# Altium project H-00488.PrjPcb
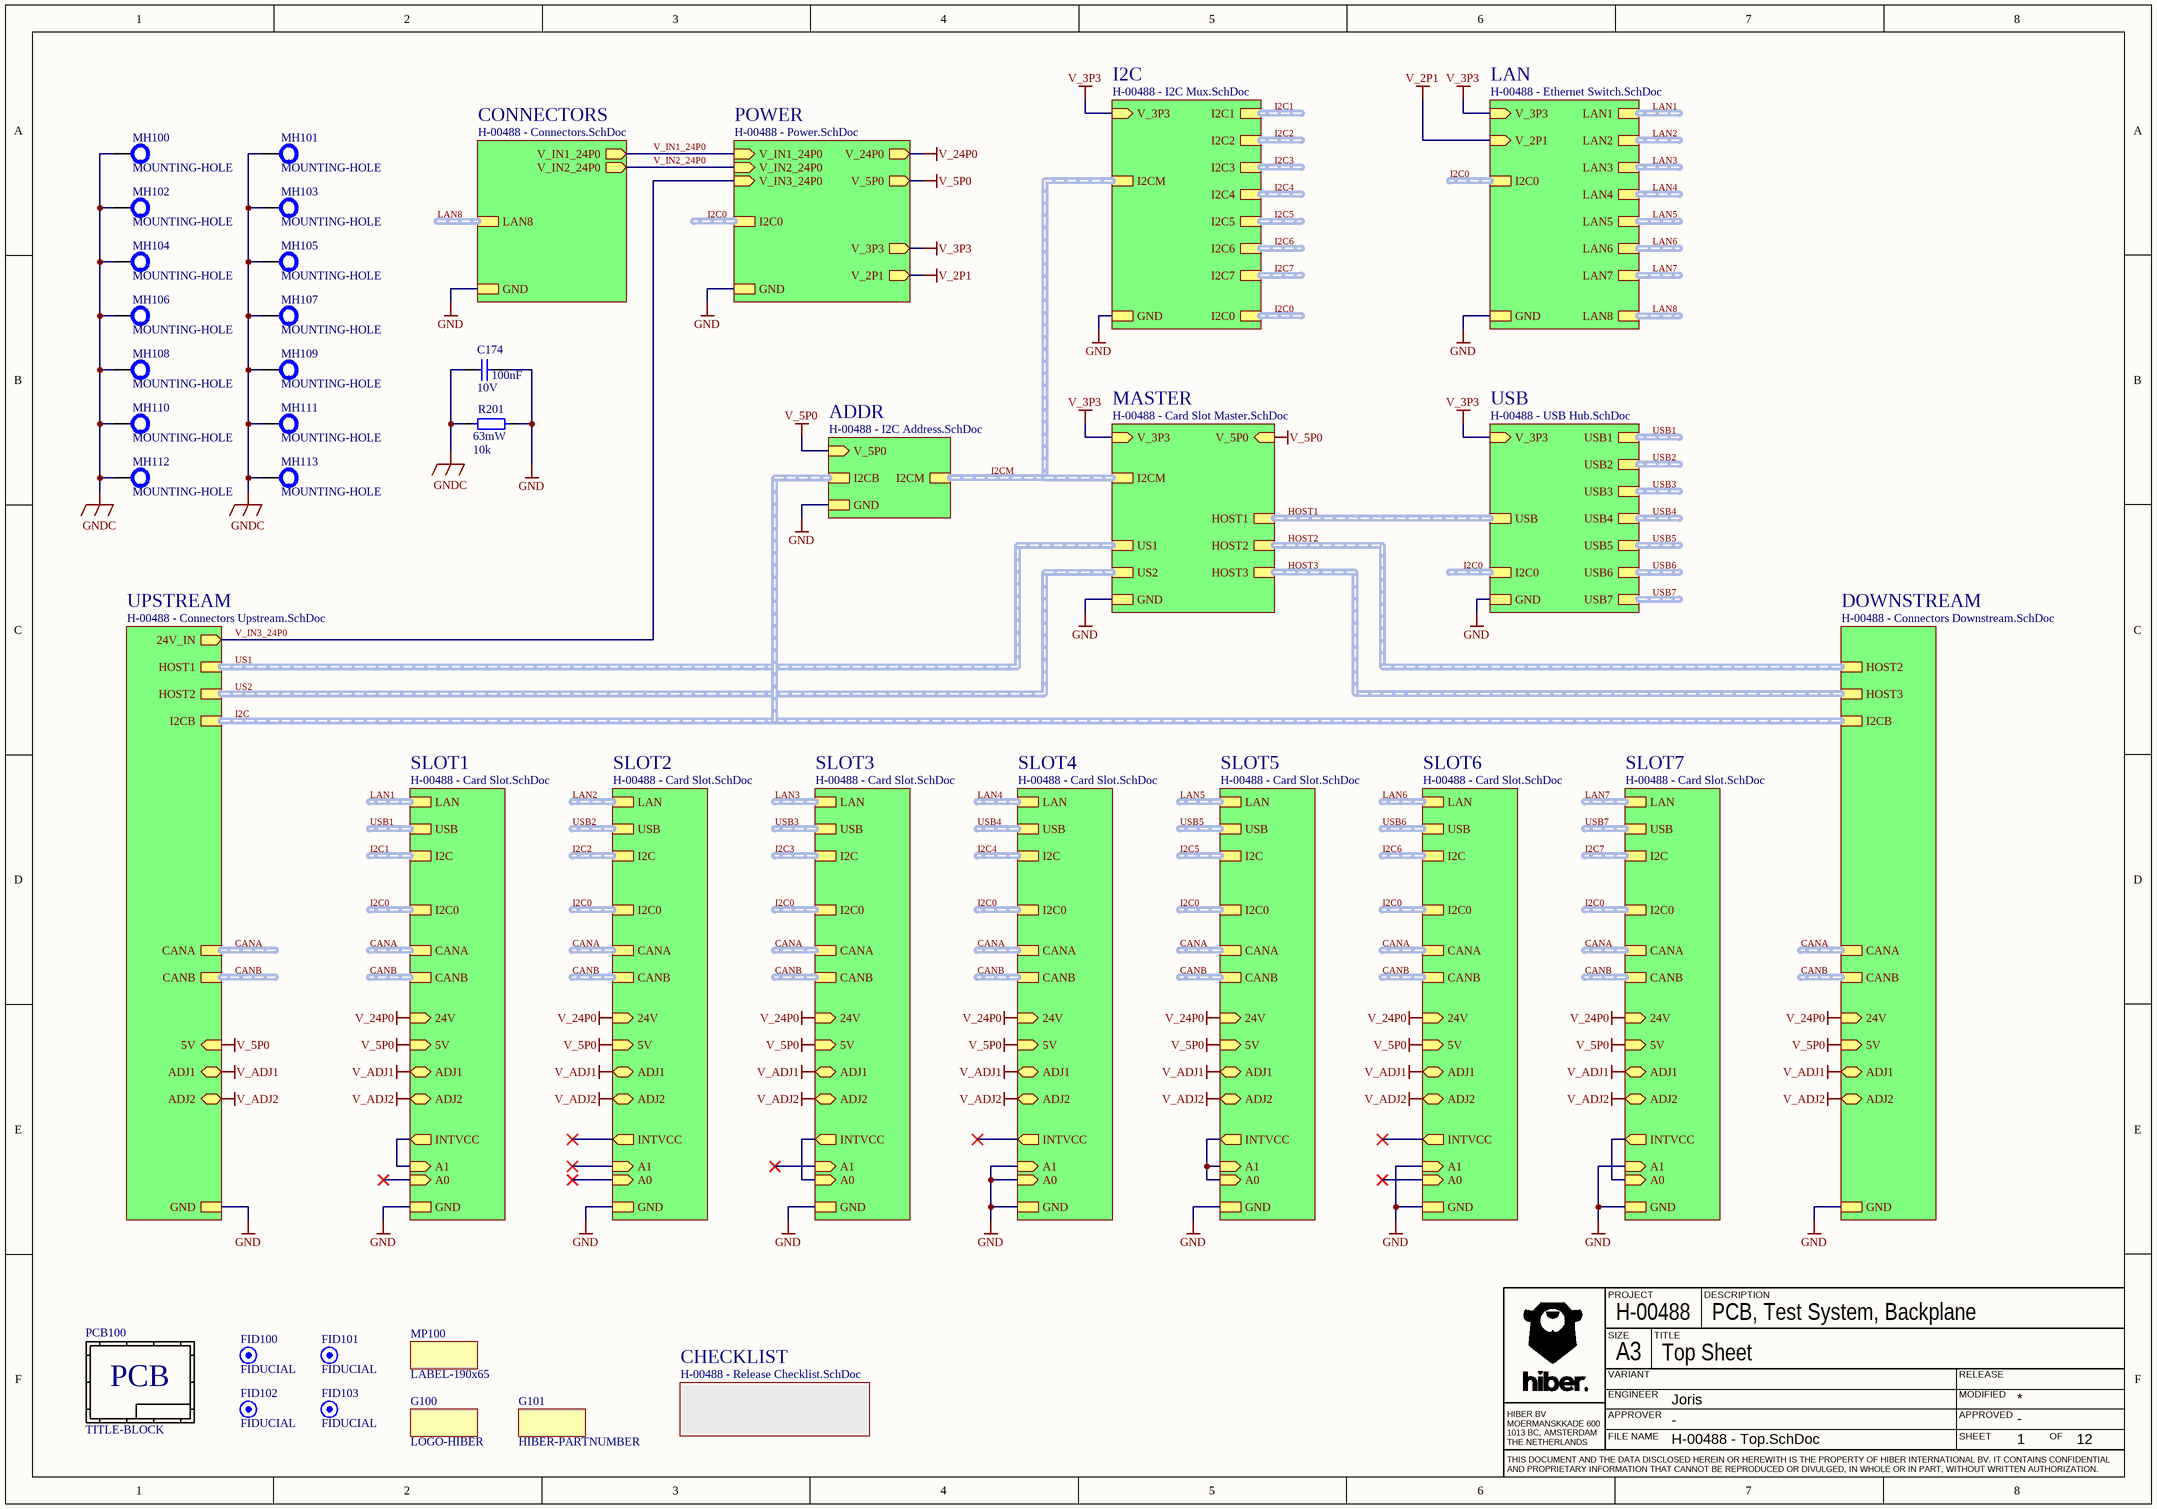
[diagram p0: H-00488 - Top.SchDoc]
ApprovedBy: -; ApprovedDate: -; Engineer: Joris; ProjectDescription: PCB, Test System, Backplane; ProjectNumber: H-00488
5 sheets, 287 parts. Net scope: strictly hierarchical (ports join the sheet entries above them; power ports are local).
Board file: H-00488.PcbDoc
Sheets:
  H-00488 - Top.SchDoc
    SLOT1 = H-00488 - Card Slot.SchDoc
    SLOT2 = H-00488 - Card Slot.SchDoc
    SLOT3 = H-00488 - Card Slot.SchDoc
    SLOT4 = H-00488 - Card Slot.SchDoc
    SLOT5 = H-00488 - Card Slot.SchDoc
    SLOT6 = H-00488 - Card Slot.SchDoc
    SLOT7 = H-00488 - Card Slot.SchDoc
    UPSTREAM = H-00488 - Connectors Upstream.SchDoc
    CONNECTORS = H-00488 - Connectors.SchDoc
    CHECKLIST = H-00488 - Release Checklist.SchDoc

## Sheet H-00488 - Top.SchDoc: Top Sheet
size 403 x 281 mm; DocumentNumber: 1; SheetNumber: 1; SheetTotal: 12

### Parts
C174  value 100nF  Rated Voltage: 10V  [CAPC100X50X55L30N]  (hidden comment: C0402C104K8RACTU)
FID100  FIDUCIAL  [FIDUCIAL_075X150]  (no BOM)
FID101  FIDUCIAL  [FIDUCIAL_075X150]  (no BOM)
FID102  FIDUCIAL  [FIDUCIAL_075X150]  (no BOM)
FID103  FIDUCIAL  [FIDUCIAL_075X150]  (no BOM)
G100  LOGO-HIBER  [HIBER_LOGO_COPPER_55x40]  (no BOM)
G101  HIBER-PARTNUMBER  [HIBER_PNSN_COPPER]  (no BOM)
MH100  MOUNTING-HOLE  [MTGP510H260V8H25]  (no BOM)
MH101  MOUNTING-HOLE  [MTGP510H260V8H25]  (no BOM)
MH102  MOUNTING-HOLE  [MTGP510H260V8H25]  (no BOM)
MH103  MOUNTING-HOLE  [MTGP510H260V8H25]  (no BOM)
MH104  MOUNTING-HOLE  [MTGP510H260V8H25]  (no BOM)
MH105  MOUNTING-HOLE  [MTGP510H260V8H25]  (no BOM)
MH106  MOUNTING-HOLE  [MTGP510H260V8H25]  (no BOM)
MH107  MOUNTING-HOLE  [MTGP510H260V8H25]  (no BOM)
MH108  MOUNTING-HOLE  [MTGP510H260V8H25]  (no BOM)
MH109  MOUNTING-HOLE  [MTGP510H260V8H25]  (no BOM)
MH110  MOUNTING-HOLE  [MTGP510H260V8H25]  (no BOM)
MH111  MOUNTING-HOLE  [MTGP510H260V8H25]  (no BOM)
MH112  MOUNTING-HOLE  [MTGP510H260V8H25]  (no BOM)
MH113  MOUNTING-HOLE  [MTGP510H260V8H25]  (no BOM)
MP100  LABEL-190x65  [LABEL_200X65_OVERLAY]
PCB100  TITLE-BLOCK  [TITLEBLOCK-A4]
R201  value 10k  Rated Power: 63mW  [RESC100X50X40L25N]  (hidden comment: CRCW040210K0FKED)

### Sub-sheets
ADDR = H-00488 - I2C Address.SchDoc (file not in this document): GND, V_5P0 (in), I2CM (harness I2C_ADDR), I2CB (harness I2C_BACKPLANE)
CHECKLIST = H-00488 - Release Checklist.SchDoc: no entries
CONNECTORS = H-00488 - Connectors.SchDoc: GND, LAN8 (harness LAN_100BASE_TX_LED), V_IN1_24P0 (out), V_IN2_24P0 (out)
DOWNSTREAM = H-00488 - Connectors Downstream.SchDoc (file not in this document): ADJ1 (bidir), 24V (in), ADJ2 (bidir), I2CB (harness I2C_MASTER), HOST3 (harness USB), HOST2 (harness USB), CANA (harness CAN), CANB (harness CAN), GND, 5V (in)
I2C = H-00488 - I2C Mux.SchDoc (file not in this document): GND, V_3P3 (in), I2C1 (harness I2C), I2C2 (harness I2C), I2C3 (harness I2C), I2C4 (harness I2C), I2C5 (harness I2C), I2C6 (harness I2C), I2C7 (harness I2C), I2C0 (harness I2C_ADDR), I2CM (harness I2C_ADDR)
LAN = H-00488 - Ethernet Switch.SchDoc (file not in this document): GND, V_3P3 (in), LAN1 (harness LAN_100BASE_TX), LAN2 (harness LAN_100BASE_TX), LAN3 (harness LAN_100BASE_TX), LAN4 (harness LAN_100BASE_TX), LAN5 (harness LAN_100BASE_TX), LAN6 (harness LAN_100BASE_TX), LAN7 (harness LAN_100BASE_TX), LAN8 (harness LAN_100BASE_TX_LED), I2C0 (harness I2C_ADDR), V_2P1 (in)
MASTER = H-00488 - Card Slot Master.SchDoc (file not in this document): HOST2 (harness USB), HOST1 (harness USB), HOST3 (harness USB), I2CM (harness I2C_ADDR), US2 (harness USB), US1 (harness USB), GND, V_3P3 (in), V_5P0 (in)
POWER = H-00488 - Power.SchDoc (file not in this document): GND, V_3P3 (out), V_5P0 (out), V_24P0 (out), V_IN1_24P0 (in), I2C0 (harness I2C_ADDR), V_IN3_24P0 (in), V_2P1 (out), V_IN2_24P0 (in)
SLOT1 = H-00488 - Card Slot.SchDoc: I2C (harness I2C), CANA (harness CAN), LAN (harness LAN_100BASE_TX), USB (harness USB), ADJ1 (bidir), 24V (in), CANB (harness CAN), 5V (in), ADJ2 (bidir), GND, I2C0 (harness I2C_ADDR), INTVCC (out), A1 (in), A0 (in)
SLOT2 = H-00488 - Card Slot.SchDoc: I2C (harness I2C), CANA (harness CAN), LAN (harness LAN_100BASE_TX), USB (harness USB), ADJ1 (bidir), 24V (in), CANB (harness CAN), 5V (in), ADJ2 (bidir), GND, I2C0 (harness I2C_ADDR), INTVCC (out), A1 (in), A0 (in)
SLOT3 = H-00488 - Card Slot.SchDoc: I2C (harness I2C), CANA (harness CAN), LAN (harness LAN_100BASE_TX), USB (harness USB), ADJ1 (bidir), 24V (in), CANB (harness CAN), 5V (in), ADJ2 (bidir), GND, I2C0 (harness I2C_ADDR), INTVCC (out), A1 (in), A0 (in)
SLOT4 = H-00488 - Card Slot.SchDoc: I2C (harness I2C), CANA (harness CAN), LAN (harness LAN_100BASE_TX), USB (harness USB), ADJ1 (bidir), 24V (in), CANB (harness CAN), 5V (in), ADJ2 (bidir), GND, I2C0 (harness I2C_ADDR), INTVCC (out), A1 (in), A0 (in)
SLOT5 = H-00488 - Card Slot.SchDoc: I2C (harness I2C), CANA (harness CAN), LAN (harness LAN_100BASE_TX), USB (harness USB), ADJ1 (bidir), 24V (in), CANB (harness CAN), 5V (in), ADJ2 (bidir), GND, I2C0 (harness I2C_ADDR), INTVCC (out), A1 (in), A0 (in)
SLOT6 = H-00488 - Card Slot.SchDoc: I2C (harness I2C), CANA (harness CAN), LAN (harness LAN_100BASE_TX), USB (harness USB), ADJ1 (bidir), 24V (in), CANB (harness CAN), 5V (in), ADJ2 (bidir), GND, I2C0 (harness I2C_ADDR), INTVCC (out), A1 (in), A0 (in)
SLOT7 = H-00488 - Card Slot.SchDoc: I2C (harness I2C), CANA (harness CAN), LAN (harness LAN_100BASE_TX), USB (harness USB), ADJ1 (bidir), 24V (in), CANB (harness CAN), 5V (in), ADJ2 (bidir), GND, I2C0 (harness I2C_ADDR), INTVCC (out), A1 (in), A0 (in)
UPSTREAM = H-00488 - Connectors Upstream.SchDoc: ADJ1 (bidir), 24V_IN (out), ADJ2 (bidir), I2CB (harness I2C_MASTER), HOST1 (harness USB), HOST2 (harness USB), CANA (harness CAN), CANB (harness CAN), GND, 5V (in)
USB = H-00488 - USB Hub.SchDoc (file not in this document): GND, V_3P3 (in), USB1 (harness USB), USB2 (harness USB), USB3 (harness USB), USB4 (harness USB), USB5 (harness USB), USB6 (harness USB), USB7 (harness USB), USB (harness USB), I2C0 (harness I2C_ADDR)

### Nets
GND: C174.2 R201.2 ; sheet LAN/GND, sheet DOWNSTREAM/GND, sheet SLOT1/GND, sheet SLOT2/GND, sheet SLOT3/GND, sheet SLOT4/GND, sheet SLOT4/A1, sheet SLOT4/A0, sheet SLOT5/GND, sheet USB/GND, sheet SLOT6/GND, sheet SLOT6/A1, sheet SLOT7/GND, sheet SLOT7/A1, sheet I2C/GND, sheet UPSTREAM/GND, sheet MASTER/GND, sheet POWER/GND, sheet CONNECTORS/GND, sheet ADDR/GND
GNDC: C174.1 MH100.1 MH101.1 MH102.1 MH103.1 MH104.1 MH105.1 MH106.1 MH107.1 MH108.1 MH109.1 MH110.1 MH111.1 MH112.1 MH113.1 R201.1
V_2P1: sheet LAN/V_2P1, sheet POWER/V_2P1
V_3P3: sheet LAN/V_3P3, sheet USB/V_3P3, sheet I2C/V_3P3, sheet MASTER/V_3P3, sheet POWER/V_3P3
V_5P0: sheet DOWNSTREAM/5V, sheet SLOT1/5V, sheet SLOT2/5V, sheet SLOT3/5V, sheet SLOT4/5V, sheet SLOT5/5V, sheet SLOT6/5V, sheet SLOT7/5V, sheet UPSTREAM/5V, sheet MASTER/V_5P0, sheet POWER/V_5P0, sheet ADDR/V_5P0
V_24P0: sheet DOWNSTREAM/24V, sheet SLOT1/24V, sheet SLOT2/24V, sheet SLOT3/24V, sheet SLOT4/24V, sheet SLOT5/24V, sheet SLOT6/24V, sheet SLOT7/24V, sheet POWER/V_24P0
V_ADJ1: sheet DOWNSTREAM/ADJ1, sheet SLOT1/ADJ1, sheet SLOT2/ADJ1, sheet SLOT3/ADJ1, sheet SLOT4/ADJ1, sheet SLOT5/ADJ1, sheet SLOT6/ADJ1, sheet SLOT7/ADJ1, sheet UPSTREAM/ADJ1
V_ADJ2: sheet DOWNSTREAM/ADJ2, sheet SLOT1/ADJ2, sheet SLOT2/ADJ2, sheet SLOT3/ADJ2, sheet SLOT4/ADJ2, sheet SLOT5/ADJ2, sheet SLOT6/ADJ2, sheet SLOT7/ADJ2, sheet UPSTREAM/ADJ2
V_IN1_24P0: sheet POWER/V_IN1_24P0, sheet CONNECTORS/V_IN1_24P0
V_IN2_24P0: sheet POWER/V_IN2_24P0, sheet CONNECTORS/V_IN2_24P0
V_IN3_24P0: sheet UPSTREAM/24V_IN, sheet POWER/V_IN3_24P0
V_INTVCC_3P3_SLOT1: sheet SLOT1/INTVCC, sheet SLOT1/A1
V_INTVCC_3P3_SLOT3: sheet SLOT3/INTVCC, sheet SLOT3/A0
V_INTVCC_3P3_SLOT5: sheet SLOT5/INTVCC, sheet SLOT5/A1, sheet SLOT5/A0
V_INTVCC_3P3_SLOT7: sheet SLOT7/INTVCC, sheet SLOT7/A0

### Buses and harness runs
harness CANA = sheet DOWNSTREAM/CANA
harness CANA = sheet SLOT1/CANA
harness CANA = sheet SLOT2/CANA
harness CANA = sheet SLOT3/CANA
harness CANA = sheet SLOT4/CANA
harness CANA = sheet SLOT5/CANA
harness CANA = sheet SLOT6/CANA
harness CANA = sheet SLOT7/CANA
harness CANA = sheet UPSTREAM/CANA
harness CANB = sheet DOWNSTREAM/CANB
harness CANB = sheet SLOT1/CANB
harness CANB = sheet SLOT2/CANB
harness CANB = sheet SLOT3/CANB
harness CANB = sheet SLOT4/CANB
harness CANB = sheet SLOT5/CANB
harness CANB = sheet SLOT6/CANB
harness CANB = sheet SLOT7/CANB
harness CANB = sheet UPSTREAM/CANB
harness HOST1 = sheet MASTER/HOST1 = sheet USB/USB
harness HOST2 = sheet DOWNSTREAM/HOST2 = sheet MASTER/HOST2
harness HOST3 = sheet DOWNSTREAM/HOST3 = sheet MASTER/HOST3
harness I2C0 = sheet I2C/I2C0
harness I2C0 = sheet LAN/I2C0
harness I2C0 = sheet POWER/I2C0
harness I2C0 = sheet SLOT1/I2C0
harness I2C0 = sheet SLOT2/I2C0
harness I2C0 = sheet SLOT3/I2C0
harness I2C0 = sheet SLOT4/I2C0
harness I2C0 = sheet SLOT5/I2C0
harness I2C0 = sheet SLOT6/I2C0
harness I2C0 = sheet SLOT7/I2C0
harness I2C0 = sheet USB/I2C0
harness I2C1 = sheet I2C/I2C1
harness I2C1 = sheet SLOT1/I2C
harness I2C2 = sheet I2C/I2C2
harness I2C2 = sheet SLOT2/I2C
harness I2C3 = sheet I2C/I2C3
harness I2C3 = sheet SLOT3/I2C
harness I2C4 = sheet I2C/I2C4
harness I2C4 = sheet SLOT4/I2C
harness I2C5 = sheet I2C/I2C5
harness I2C5 = sheet SLOT5/I2C
harness I2C6 = sheet I2C/I2C6
harness I2C6 = sheet SLOT6/I2C
harness I2C7 = sheet I2C/I2C7
harness I2C7 = sheet SLOT7/I2C
harness I2C = sheet ADDR/I2CB = sheet DOWNSTREAM/I2CB = sheet UPSTREAM/I2CB
harness I2CM = sheet ADDR/I2CM = sheet I2C/I2CM = sheet MASTER/I2CM
harness LAN1 = sheet LAN/LAN1
harness LAN1 = sheet SLOT1/LAN
harness LAN2 = sheet LAN/LAN2
harness LAN2 = sheet SLOT2/LAN
harness LAN3 = sheet LAN/LAN3
harness LAN3 = sheet SLOT3/LAN
harness LAN4 = sheet LAN/LAN4
harness LAN4 = sheet SLOT4/LAN
harness LAN5 = sheet LAN/LAN5
harness LAN5 = sheet SLOT5/LAN
harness LAN6 = sheet LAN/LAN6
harness LAN6 = sheet SLOT6/LAN
harness LAN7 = sheet LAN/LAN7
harness LAN7 = sheet SLOT7/LAN
harness LAN8 = sheet CONNECTORS/LAN8
harness LAN8 = sheet LAN/LAN8
harness US1 = sheet MASTER/US1 = sheet UPSTREAM/HOST1
harness US2 = sheet MASTER/US2 = sheet UPSTREAM/HOST2
harness USB1 = sheet SLOT1/USB
harness USB1 = sheet USB/USB1
harness USB2 = sheet SLOT2/USB
harness USB2 = sheet USB/USB2
harness USB3 = sheet SLOT3/USB
harness USB3 = sheet USB/USB3
harness USB4 = sheet SLOT4/USB
harness USB4 = sheet USB/USB4
harness USB5 = sheet SLOT5/USB
harness USB5 = sheet USB/USB5
harness USB6 = sheet SLOT6/USB
harness USB6 = sheet USB/USB6
harness USB7 = sheet SLOT7/USB
harness USB7 = sheet USB/USB7

### Notes on the sheet
- PROJECT
- DESCRIPTION
- SIZE
- ENGINEER
- VARIANT
- A3
- TITLE
- MODIFIED
- RELEASE
- HIBER BV
  MOERMANSKKADE 600
  1013 BC, AMSTERDAM
  THE NETHERLANDS
- FILE NAME
- APPROVER
- SHEET
- APPROVED
- OF
- THIS DOCUMENT AND THE DATA DISCLOSED HEREIN OR HEREWITH IS THE PROPERTY OF HIBER INTERNATIONAL BV. IT CONTAINS CONFIDENTIAL AND PROPRIETARY INFORMATION THAT CANNOT BE REPRODUCED OR DIVULGED, IN WHOLE OR IN PART, WITHOUT WRITTEN AUTHORIZATION.
- (in symbol CMP-00011-3) PCB

### Library data of the parts
C174 = CMP-00367-3: CAP Standard 0402 (1005) 100,0nF 10V X7R (Standard); Type: Ceramic; Tolerance: 10%; Termination Finish: 100% Matte Sn; Qualification: Standard; RoHS: Yes; Mount: SMT; Case/Package: 0402 (1005); Failure Rate: N/A; Pins: 2; Dielectric: X7R
FID100-FID103 = CMP-00519-1
G100 = CMP-00553-6: Hiber Logo
G101 = CMP-00558-6: Hiber Fabrication Partnumber
MH100-MH113 = CMP-00668-11: Mounting Hole
MP100 = CMP-00552-5: Label Placeholder 0.75" x 0.25" (Zebra 10015764)
PCB100 = CMP-00011-3: Title Block and PCB BOM Line Item
R201 = CMP-00294-7: RES Standard Thick Film 0402 10K0 ±1% 0,063W; Qualification: Automotive; Rated Voltage: 50V; Mount: Surface Mount; Termination Finish: Pure tin solder contacts on Ni barrier layer; Tolerance: 1%; Type: Standard Thick Film; Case/Package: 0402 (1005); Failure Rate: N/A; Pins: 2; RoHS: Yes

## Sheet H-00488 - Card Slot.SchDoc: Card Slot
size 403 x 281 mm; DocumentNumber: 8; SheetNumber: 8; SheetTotal: 12
Used 7 times, as channels SLOT1, SLOT2, SLOT3, SLOT4, SLOT5, SLOT6, SLOT7. Parts and nets are listed once, with the designators drawn on the sheet.
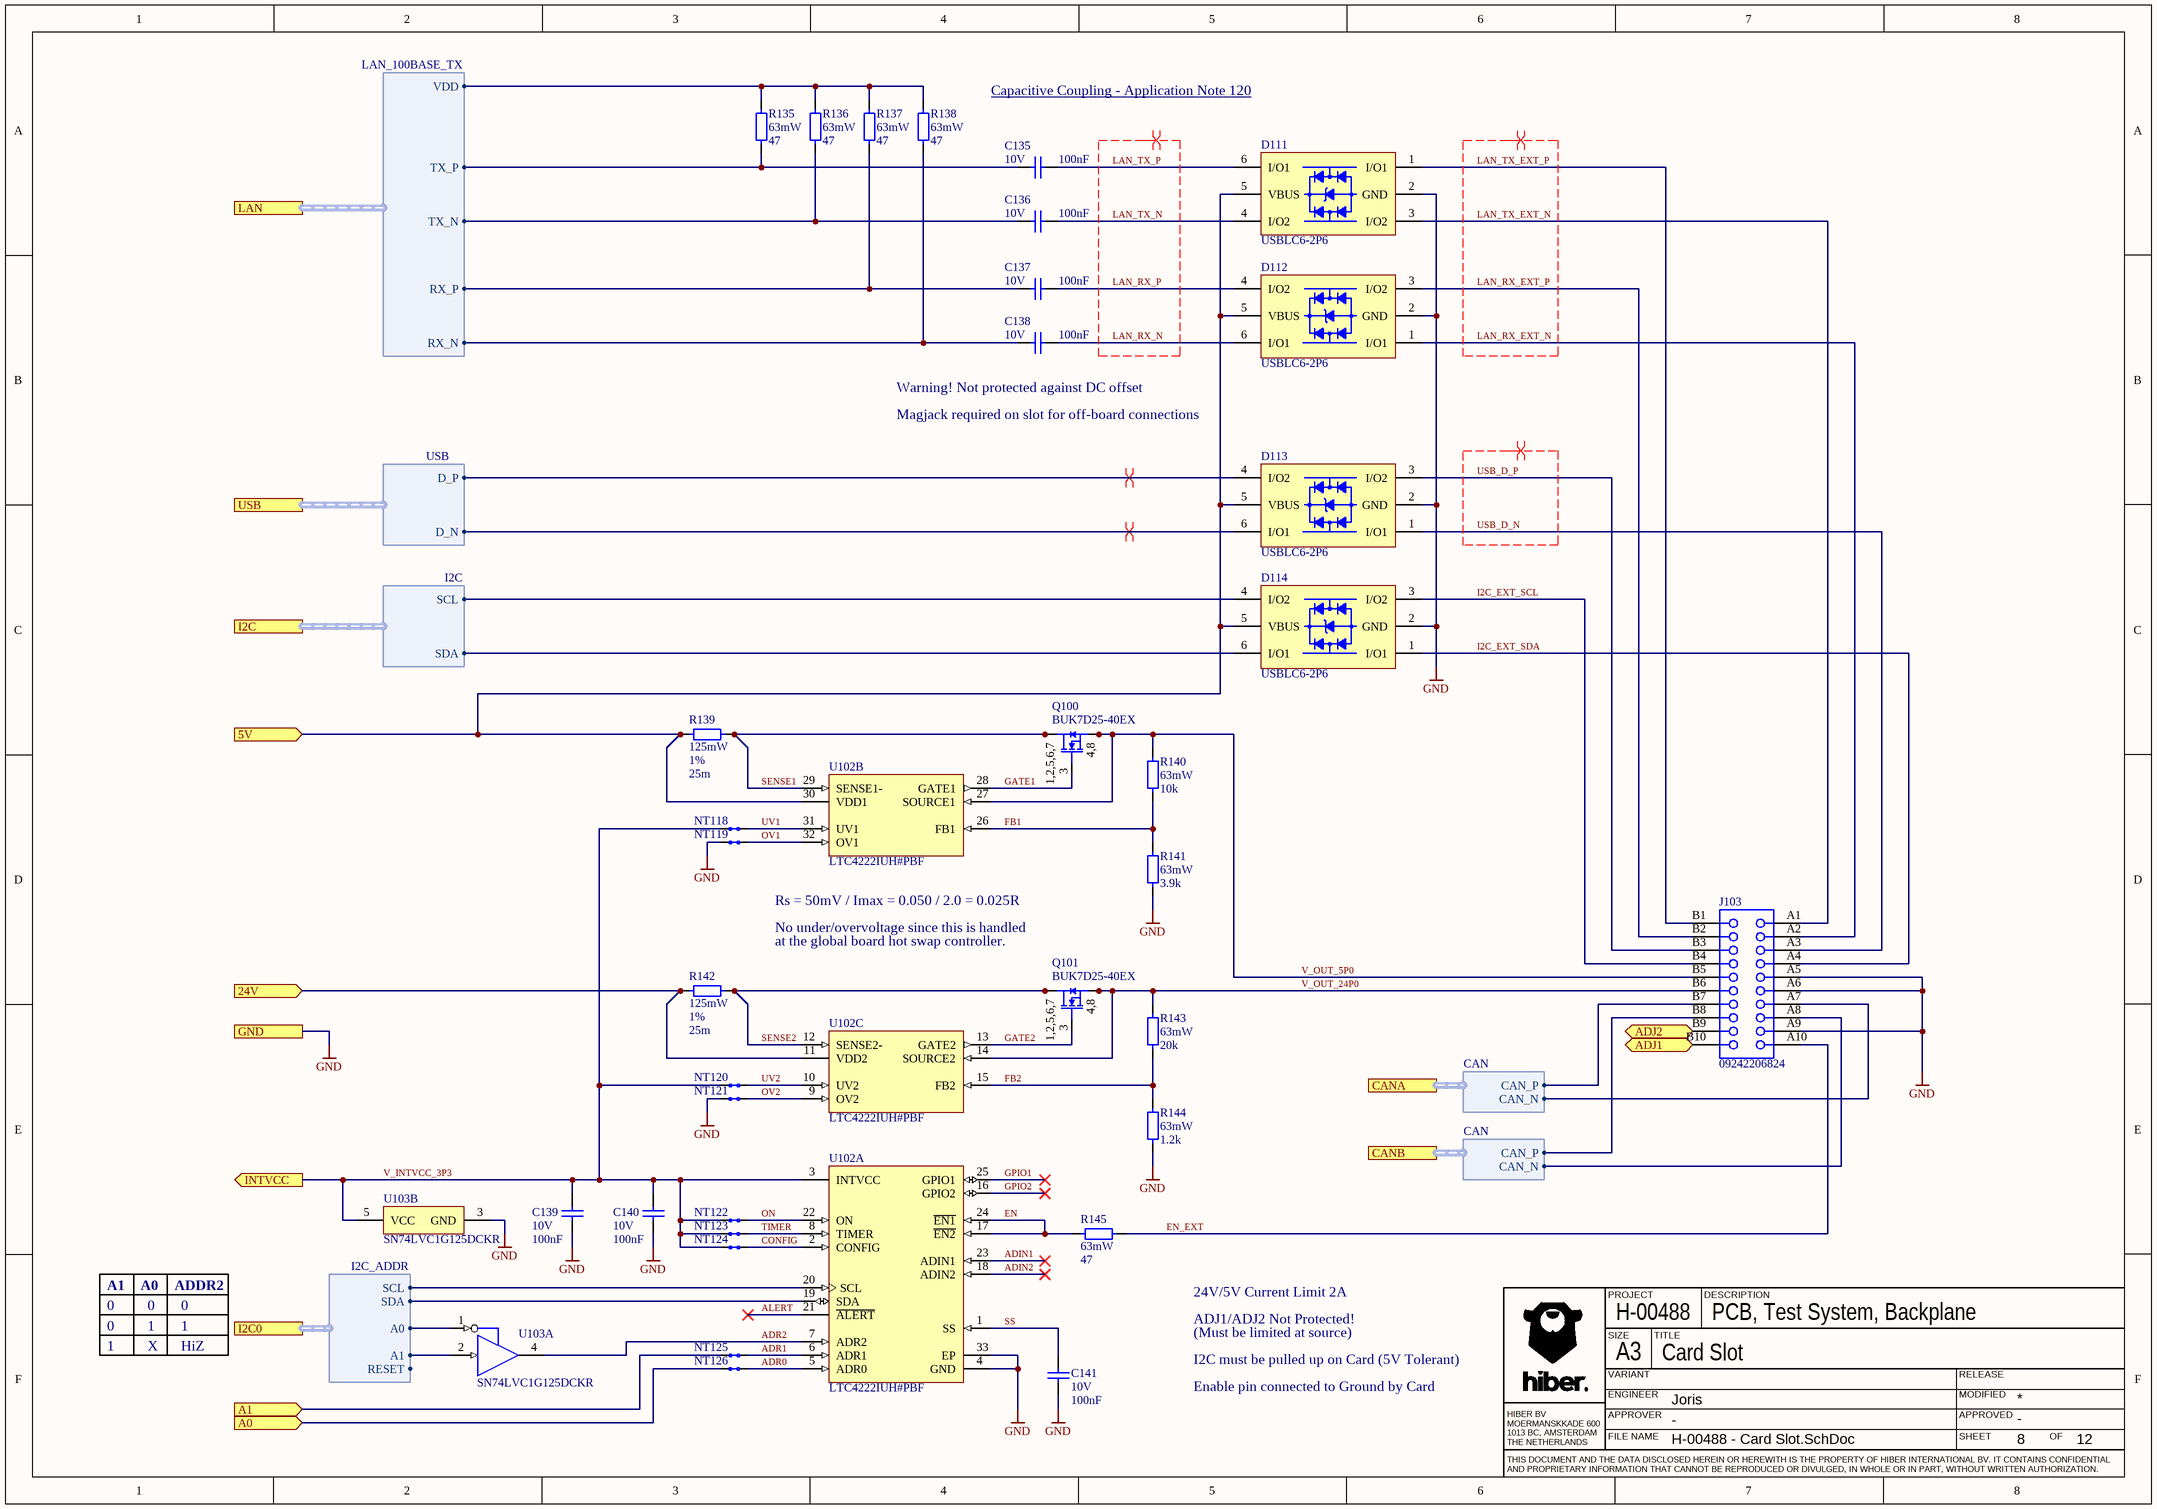
[diagram p1: H-00488 - Card Slot.SchDoc]

### Parts
C135  value 100nF  Rated Voltage: 10V  [CAPC100X50X55L30N]  (hidden comment: C0402C104K8RACTU)
C136  value 100nF  Rated Voltage: 10V  [CAPC100X50X55L30N]  (hidden comment: C0402C104K8RACTU)
C137  value 100nF  Rated Voltage: 10V  [CAPC100X50X55L30N]  (hidden comment: C0402C104K8RACTU)
C138  value 100nF  Rated Voltage: 10V  [CAPC100X50X55L30N]  (hidden comment: C0402C104K8RACTU)
C139  value 100nF  Rated Voltage: 10V  [CAPC100X50X55L30N]  (hidden comment: C0402C104K8RACTU)
C140  value 100nF  Rated Voltage: 10V  [CAPC100X50X55L30N]  (hidden comment: C0402C104K8RACTU)
C141  value 100nF  Rated Voltage: 10V  [CAPC100X50X55L30N]  (hidden comment: C0402C104K8RACTU)
D111  USBLC6-2P6  [DIOSOFL6P50_160X160X95L29X26]
D112  USBLC6-2P6  [DIOSOFL6P50_160X160X95L29X26]
D113  USBLC6-2P6  [DIOSOFL6P50_160X160X95L29X26]
D114  USBLC6-2P6  [DIOSOFL6P50_160X160X95L29X26]
J103  09242206824  [HARTING_09242206824]
NT118  NET-TIE  [NT200]  (value not drawn)  (net tie, no BOM)
NT119  NET-TIE  [NT200]  (value not drawn)  (net tie, no BOM)
NT120  NET-TIE  [NT200]  (value not drawn)  (net tie, no BOM)
NT121  NET-TIE  [NT200]  (value not drawn)  (net tie, no BOM)
NT122  NET-TIE  [NT200]  (value not drawn)  (net tie, no BOM)
NT123  NET-TIE  [NT200]  (value not drawn)  (net tie, no BOM)
NT124  NET-TIE  [NT200]  (value not drawn)  (net tie, no BOM)
NT125  NET-TIE  [NT200]  (value not drawn)  (net tie, no BOM)
NT126  NET-TIE  [NT200]  (value not drawn)  (net tie, no BOM)
Q100  BUK7D25-40EX  [NEXPERIA_SOT1220]
Q101  BUK7D25-40EX  [NEXPERIA_SOT1220]
R135  value 47  Rated Power: 63mW  [RESC100X50X40L25N]  (hidden comment: CRCW040247R0FKED)
R136  value 47  Rated Power: 63mW  [RESC100X50X40L25N]  (hidden comment: CRCW040247R0FKED)
R137  value 47  Rated Power: 63mW  [RESC100X50X40L25N]  (hidden comment: CRCW040247R0FKED)
R138  value 47  Rated Power: 63mW  [RESC100X50X40L25N]  (hidden comment: CRCW040247R0FKED)
R139  value 25m  Rated Power: 125mW  Tolerance: 1%  [RESC200X125X70L40N]  (hidden comment: WSL0805R0250FEA18)
R140  value 10k  Rated Power: 63mW  [RESC100X50X40L25N]  (hidden comment: CRCW040210K0FKED)
R141  value 3.9k  Rated Power: 63mW  [RESC100X50X40L25N]  (hidden comment: CRCW04023K90FKED)
R142  value 25m  Rated Power: 125mW  Tolerance: 1%  [RESC200X125X70L40N]  (hidden comment: WSL0805R0250FEA18)
R143  value 20k  Rated Power: 63mW  [RESC100X50X40L25N]  (hidden comment: CRCW040220K0FKED)
R144  value 1.2k  Rated Power: 63mW  [RESC100X50X40L25N]  (hidden comment: CRCW04021K20FKED)
R145  value 47  Rated Power: 63mW  [RESC100X50X40L25N]  (hidden comment: CRCW040247R0FKED)
U102  LTC4222IUH#PBF  [QFN33P50_500X500X80L40X25T345]  (parts A,B,C of 3)
U103  SN74LVC1G125DCKR  [SOT23-5P65_210X110L36X22]  (parts A,B of 2)

### Ports
5V (in), 24V (in), A0 (in), A1 (in), ADJ1 (bidir), ADJ2 (bidir), CANA (harness CAN), CANB (harness CAN), GND, I2C0 (harness I2C_ADDR), I2C (harness I2C), INTVCC (out), LAN (harness LAN_100BASE_TX), USB (harness USB)

### Harnesses
CAN: CAN_N, CAN_P
I2C: SCL, SDA
I2C_ADDR: SDA, SCL, A0, A1, RESET
LAN_100BASE_TX: RX_N, RX_P, TX_P, TX_N, VDD
USB: D_P, D_N

### Nets
GND: C139.2 C140.2 C141.2 D111.2(GND) D112.2(GND) D113.2(GND) D114.2(GND) J103.A5 J103.A6 J103.A9 NT119.1 NT121.1 R141.2 R144.2 U102.4(GND) U102.33(EP) U103.3(GND) ; port GND
5V: D111.5(VBUS) D112.5(VBUS) D113.5(VBUS) D114.5(VBUS) R139.2 U102.30(VDD1) ; port 5V
24V: R142.2 U102.11(VDD2) ; port 24V
A0: NT126.1 ; port A0
A1: NT125.1 ; port A1
ADIN1: U102.23(ADIN1)
ADIN2: U102.18(ADIN2)
ADJ1: J103.B10 ; port ADJ1
ADJ2: J103.B9 ; port ADJ2
ADR0: NT126.2 U102.5(ADR0)
ADR1: NT125.2 U102.6(ADR1)
ADR2: U102.7(ADR2) U103.4(Y)
ALERT: U102.21(~{ALERT})
CONFIG: NT124.2 U102.2(CONFIG)
EN: R145.1 U102.17(~{EN2}) U102.24(~{EN1})
EN_EXT: J103.A10 R145.2
FB1: R140.2 R141.1 U102.26(FB1)
FB2: R143.2 R144.1 U102.15(FB2)
GATE1: Q100.3(G) U102.28(GATE1)
GATE2: Q101.3(G) U102.13(GATE2)
GPIO1: U102.25(GPIO1)
GPIO2: U102.16(GPIO2)
I2C_EXT_SCL: D114.3(I/O2) J103.B4
I2C_EXT_SDA: D114.1(I/O1) J103.A4
LAN_RX_EXT_N: D112.1(I/O1) J103.A2
LAN_RX_EXT_P: D112.3(I/O2) J103.B2
LAN_RX_N: C138.2 D112.6(I/O1)
LAN_RX_P: C137.2 D112.4(I/O2)
LAN_TX_EXT_N: D111.3(I/O2) J103.A1
LAN_TX_EXT_P: D111.1(I/O1) J103.B1
LAN_TX_N: C136.2 D111.4(I/O2)
LAN_TX_P: C135.2 D111.6(I/O1)
ON: NT122.2 U102.22(ON)
OV1: NT119.2 U102.32(OV1)
OV2: NT121.2 U102.9(OV2)
SENSE1: Q100.1(D) Q100.2(D) Q100.5(D) Q100.6(D) Q100.7(D) R139.1 U102.29(SENSE1-)
SENSE2: Q101.1(D) Q101.2(D) Q101.5(D) Q101.6(D) Q101.7(D) R142.1 U102.12(SENSE2-)
SS: C141.1 U102.1(SS)
TIMER: NT123.2 U102.8(TIMER)
USB_D_N: D113.1(I/O1) J103.A3
USB_D_P: D113.3(I/O2) J103.B3
UV1: NT118.2 U102.31(UV1)
UV2: NT120.2 U102.10(UV2)
V_INTVCC_3P3: C139.1 C140.1 NT118.1 NT120.1 NT122.1 NT123.1 NT124.1 U102.3(INTVCC) U103.5(VCC) ; port INTVCC
V_OUT_5P0: J103.B5 Q100.4(S) Q100.8(S) R140.1 U102.27(SOURCE1)
V_OUT_24P0: J103.B6 Q101.4(S) Q101.8(S) R143.1 U102.14(SOURCE2)
NetC135_1: C135.1 R135.1 ; port LAN.TX_P
NetC136_1: C136.1 R136.1 ; port LAN.TX_N
NetC137_1: C137.1 R137.1 ; port LAN.RX_P
NetC138_1: C138.1 R138.1 ; port LAN.RX_N
NetD113_4: D113.4(I/O2) ; port USB.D_P
NetD113_6: D113.6(I/O1) ; port USB.D_N
NetD114_4: D114.4(I/O2) ; port I2C.SCL
NetD114_6: D114.6(I/O1) ; port I2C.SDA
NetJ103_A7: J103.A7 ; port CANA.CAN_N
NetJ103_A8: J103.A8 ; port CANB.CAN_N
NetJ103_B7: J103.B7 ; port CANA.CAN_P
NetJ103_B8: J103.B8 ; port CANB.CAN_P
NetR135_2: R135.2 R136.2 R137.2 R138.2 ; port LAN.VDD
NetU102_19: U102.19(SDA) ; port I2C0.SDA
NetU102_20: U102.20(SCL) ; port I2C0.SCL
NetU103_1: U103.1(~{OE}) ; port I2C0.A0
NetU103_2: U103.2(A) ; port I2C0.A1

### Channels
SLOT1: designators end in _1; ports 5V=V_5P0 24V=V_24P0 A0=NetNT126_1_1 A1=V_INTVCC_3P3_SLOT1 ADJ1=V_ADJ1 ADJ2=V_ADJ2 GND=GND INTVCC=V_INTVCC_3P3_SLOT1
SLOT2: designators end in _2; ports 5V=V_5P0 24V=V_24P0 A0=NetNT126_2_1 A1=NetNT125_2_1 ADJ1=V_ADJ1 ADJ2=V_ADJ2 GND=GND INTVCC=V_INTVCC_3P3_SLOT2
SLOT3: designators end in _3; ports 5V=V_5P0 24V=V_24P0 A0=V_INTVCC_3P3_SLOT3 A1=NetNT125_3_1 ADJ1=V_ADJ1 ADJ2=V_ADJ2 GND=GND INTVCC=V_INTVCC_3P3_SLOT3
SLOT4: designators end in _4; ports 5V=V_5P0 24V=V_24P0 A0=GND A1=GND ADJ1=V_ADJ1 ADJ2=V_ADJ2 GND=GND INTVCC=V_INTVCC_3P3_SLOT4
SLOT5: designators end in _5; ports 5V=V_5P0 24V=V_24P0 A0=V_INTVCC_3P3_SLOT5 A1=V_INTVCC_3P3_SLOT5 ADJ1=V_ADJ1 ADJ2=V_ADJ2 GND=GND INTVCC=V_INTVCC_3P3_SLOT5
SLOT6: designators end in _6; ports 5V=V_5P0 24V=V_24P0 A0=NetNT126_6_1 A1=GND ADJ1=V_ADJ1 ADJ2=V_ADJ2 GND=GND INTVCC=V_INTVCC_3P3_SLOT6
SLOT7: designators end in _7; ports 5V=V_5P0 24V=V_24P0 A0=V_INTVCC_3P3_SLOT7 A1=GND ADJ1=V_ADJ1 ADJ2=V_ADJ2 GND=GND INTVCC=V_INTVCC_3P3_SLOT7

### Layout directives
differential pair; differential pair class DIFF_LAN: LAN_RX_EXT_N, LAN_RX_EXT_P, LAN_RX_N, LAN_RX_P, LAN_TX_EXT_N, LAN_TX_EXT_P, LAN_TX_N, LAN_TX_P
differential pair; differential pair class DIFF_USB: USB1.D_N_SLOT1, USB1.D_P_SLOT1, USB_D_N, USB_D_P

### Notes on the sheet
- Capacitive Coupling - Application Note 120 <http://ww1.microchip.com/downloads/en/AppNotes/Capacitive%20Coupling%20Ethernet%20Transceivers%20without%20Using%20Transformers.pdf>
- (near C138) Warning! Not protected against DC offset
- Magjack required on slot for off-board connections
- Rs = 50mV / Imax = 0.050 / 2.0 = 0.025R
- No under/overvoltage since this is handled
- (near Q101) at the global board hot swap controller.
- A1
- 0
- A0
- ADDR2
- 24V/5V Current Limit 2A
- ADJ1/ADJ2 Not Protected!
- 1
- X
- HiZ
- I2C must be pulled up on Card (5V Tolerant)
- Enable pin connected to Ground by Card
- (Must be limited at source)
- PROJECT
- DESCRIPTION
- SIZE
- ENGINEER
- VARIANT
- A3
- TITLE
- MODIFIED
- RELEASE
- HIBER BV
  MOERMANSKKADE 600
  1013 BC, AMSTERDAM
  THE NETHERLANDS
- FILE NAME
- APPROVER
- SHEET
- APPROVED
- OF
- THIS DOCUMENT AND THE DATA DISCLOSED HEREIN OR HEREWITH IS THE PROPERTY OF HIBER INTERNATIONAL BV. IT CONTAINS CONFIDENTIAL AND PROPRIETARY INFORMATION THAT CANNOT BE REPRODUCED OR DIVULGED, IN WHOLE OR IN PART, WITHOUT WRITTEN AUTHORIZATION.
- (in symbol CMP-01110-3) 1,2,5,6,7; 4,8

### Library data of the parts
C135-C141 = CMP-00367-3: as C174 on sheet H-00488 - Top; Termination Finish: 100% Matte Sn; Qualification: Standard; RoHS: Yes; Mount: SMT; Case/Package: 0402 (1005); Failure Rate: N/A; Pins: 2; Dielectric: X7R
D111-D114 = CMP-00780-2: TVS DIODE 5.25VWM 17VC SOT666; Reverse Breakdown Voltage: 6V; ESD Protection: Yes; Max Reverse Leakage Current: 150nA; Number of Elements: 1; Clamping Voltage: 17V; Direction: Bidirectional, Unidirectional; Capacitance: 3.5pF; Working Voltage: 5V; Number of Channels: 2; Test Current: 1mA; Peak Pulse Current: 5A; Element Configuration: Dual; Qualification: Standard; Max Operating Temperature: 125°C; Lead Free: Lead Free; Contact Plating: Matte, Tin; Package Quantity: 1; Case/Package: SOT-666; Min Operating Temperature: -40°C; Length: 1.7mm; Breakdown Voltage: 6V; Packaging: Tape and Reel; REACH SVHC: No SVHC; Termination: SMD/SMT; Mount: Surface Mount; Power Line Protection: Yes; Radiation Hardening: No; RoHS: Yes; Leakage Current: 150nA; Polarity: Bidirectional, Unidirectional; Depth: 1.3mm; Number of Bidirectional Channels: 2; Number of Pins: 6; Height: 0.6mm; Reverse Standoff Voltage: 5V; Width: 1.3mm; Min Breakdown Voltage: 6V; Operating Supply Voltage: 5V; Max Breakdown Voltage: 6V
J103 = CMP-01077-1: Board Euro Connector; RoHS: Yes; Mount: TH; Connector Type: BOARD EURO CONNECTOR
NT118-NT126 = CMP-00523-9: Net Tie, Inline
Q100 Q101 = CMP-01110-3: BUK7D25 Series 40V Surface-Mounted N-channel Trench MOSFET - SOT1118; Qualification: Standard; Mount: Surface-Mount; Case/Package: SOT1220; RoHS: Yes
R135-R138 R145 = CMP-00238-8: RES Standard Thick Film 0402 47R0 ±1% 0,063W; Qualification: Automotive; Rated Voltage: 50V; Mount: Surface Mount; Termination Finish: Pure tin solder contacts on Ni barrier layer; Case/Package: 0402 (1005); Pins: 2; Tolerance: 1%; Failure Rate: N/A; Type: Standard Thick Film; RoHS: Yes
R139 R142 = CMP-01104-2: RES Power Metal Strip 0805 0R025 ±1% 0,125W; Qualification: Automotive; Case/Package: 0805(2012); RoHS: Yes; Pins: 2; Type: Power Metal Strip; Mount: Surface Mount
R140 = CMP-00294-7: as R201 on sheet H-00488 - Top; Mount: Surface Mount; Termination Finish: Pure tin solder contacts on Ni barrier layer; Case/Package: 0402 (1005); Pins: 2; Tolerance: 1%; Failure Rate: N/A; Type: Standard Thick Film; RoHS: Yes
R141 = CMP-00284-8: RES Standard Thick Film 0402 3K90 ±1% 0,063W; Qualification: Automotive; Rated Voltage: 50V; Mount: Surface Mount; Termination Finish: Pure tin solder contacts on Ni barrier layer; Case/Package: 0402 (1005); Pins: 2; Tolerance: 1%; Failure Rate: N/A; Type: Standard Thick Film; RoHS: Yes
R143 = CMP-00301-7: RES Standard Thick Film 0402 20K0 ±1% 0,063W; Qualification: Automotive; Rated Voltage: 50V; Mount: Surface Mount; Termination Finish: Pure tin solder contacts on Ni barrier layer; Case/Package: 0402 (1005); Pins: 2; Tolerance: 1%; Failure Rate: N/A; Type: Standard Thick Film; RoHS: Yes
R144 = CMP-00272-8: RES Standard Thick Film 0402 1K20 ±1% 0,063W; Qualification: Automotive; Rated Voltage: 50V; Mount: Surface Mount; Termination Finish: Pure tin solder contacts on Ni barrier layer; Case/Package: 0402 (1005); Pins: 2; Tolerance: 1%; Failure Rate: N/A; Type: Standard Thick Film; RoHS: Yes
U102 = CMP-01087-7: Power Supply Support Circuit, Adjustable, 2 Channel, CMOS, PQCC32; Adjustable Threshold: Yes; Supply Voltage-Min (Vsup): 2.9V; Supply Voltage-Nom (Vsup): 12V; Number of Channels: 2; Time @ Peak Reflow Temperature-Max (s): 30s; Number of Functions: 1; Supply Voltage-Max (Vsup): 29V; Package Body Material: Plastic; Qualification Status: Not Qualified; Package Style: CHIP CARRIER, HEAT SINK/SLUG, VERY THIN PROFILEMeter; Terminal Pitch: 0.5mm; Moisture Sensitivity Level: 1; Width: 5mm; Surface Mount: Yes; Terminal Position: QUAD; Terminal Finish: Tin; Terminal Form: No Lead; Analog IC - Other Type: POWER SUPPLY SUPPORT CIRCUIT; Max Operating Temperature: 85°C; Package Shape: Square; Height - Seated (Max): 0.8mm; JESD-30 Code: S-PQCC-N32; JESD-609 Code: e3; Temperature Grade: INDUSTRIAL; Peak Reflow Temperature (Cel): 260°C; Min Operating Temperature: -40°C; Number of Pins: 32; Package Code: HVQCCN; Length: 5mm
U103 = CMP-01092-2: Bus Driver, LVC/LCX/Z Series, 1-Func, 1-Bit, True Output, CMOS, PDSO5; Output Characteristics: 3-STATE; Supply Voltage-Min (Vsup): 1.65V; Number of Functions: 1; Max I(ol): 24mA; Supply Voltage-Max (Vsup): 5.5V; Number of Ports: 2; Qualification Status: Not Qualified; Load/Preset Input: Yes; Propagation Delay (tpd): 9ns; Package Body Material: Plastic; Load Capacitance (CL): 50pF; Package Equivalence Code: TSSOP5/6,.08; Prop. Delay@Nom-Sup: 4.5ns; Power Supplies: 3.3V; Control Type: ENABLE LOW; Height - Seated (Max): 1.1mm; Peak Reflow Temperature (Cel): 260°C; Surface Mount: Yes; Packaging: Tape and Reel; Logic IC Type: BUS DRIVER; Technology: CMOS; JESD-609 Code: e4; Max Operating Temperature: 125°C; Length: 2mm; Temperature Grade: AUTOMOTIVE; Min Operating Temperature: -40°C; Number of Bits: 1; Terminal Finish: Nickel; Package Code: TSSOP; JESD-30 Code: R-PDSO-G5; Package Shape: Rectangular; Number of Pins: 5; Package Style: SMALL OUTLINE, THIN PROFILE, SHRINK PITCHMeter; Output Polarity: True; Moisture Sensitivity Level: 1; Width: 1.25mm; Terminal Form: Gull Wing; Terminal Position: DUAL; Terminal Pitch: 0.65mm; Supply Voltage-Nom (Vsup): 3.3V

## Sheet H-00488 - Connectors Upstream.SchDoc: Connectors Upstream
size 403 x 281 mm; DocumentNumber: 11; SheetNumber: 11; SheetTotal: 12
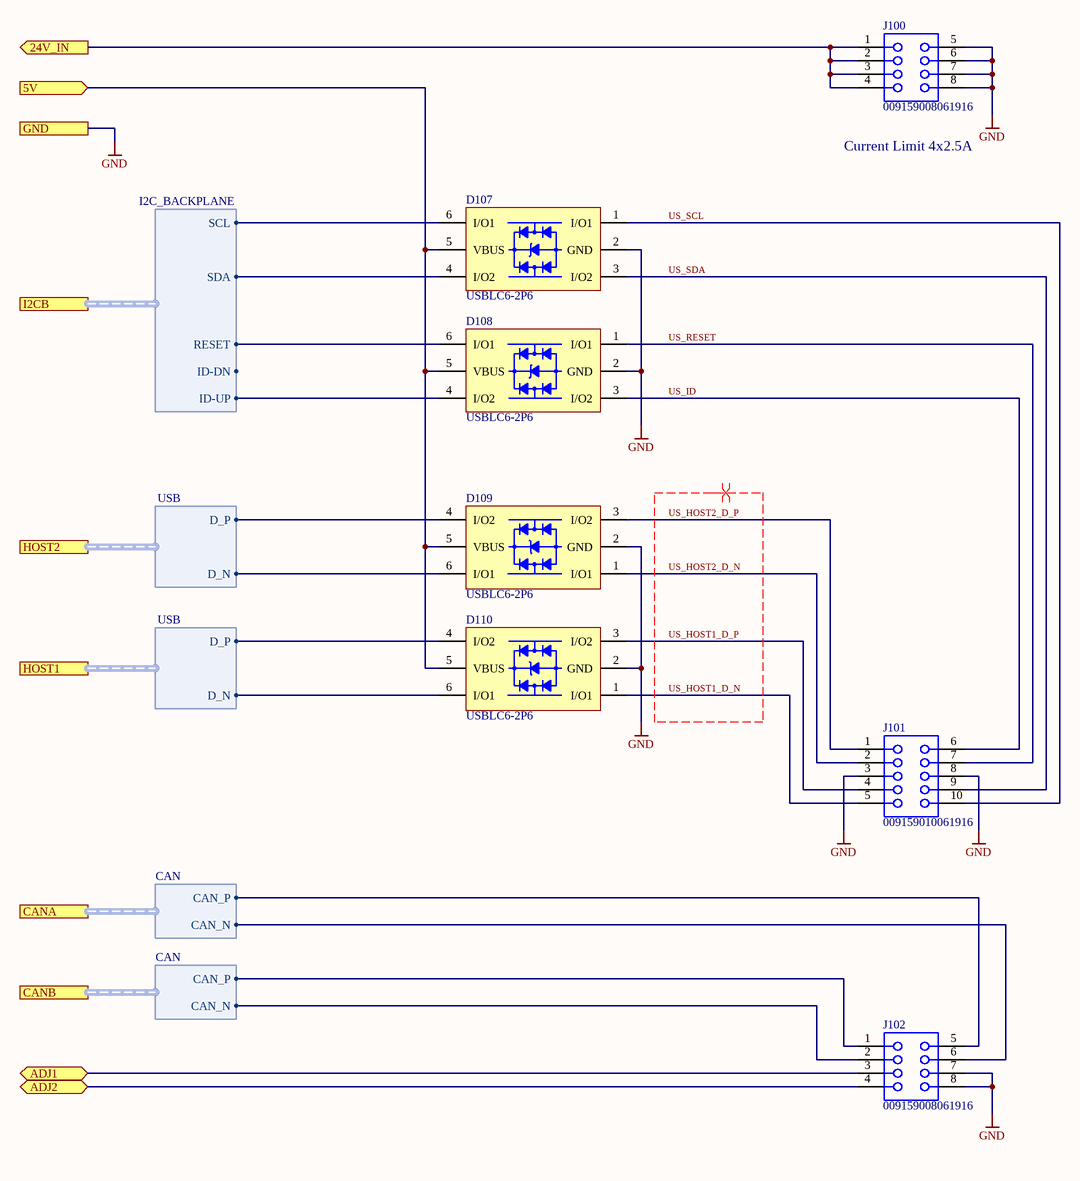
[diagram p2: H-00488 - Connectors Upstream.SchDoc]

### Parts
D107  USBLC6-2P6  [DIOSOFL6P50_160X160X95L29X26]
D108  USBLC6-2P6  [DIOSOFL6P50_160X160X95L29X26]
D109  USBLC6-2P6  [DIOSOFL6P50_160X160X95L29X26]
D110  USBLC6-2P6  [DIOSOFL6P50_160X160X95L29X26]
J100  009159008061916  [AVX_00-9159-008]
J101  009159010061916  [AVX_00-9159-010]
J102  009159008061916  [AVX_00-9159-008]

### Ports
5V (in), 24V_IN (out), ADJ1 (bidir), ADJ2 (bidir), CANA (harness CAN), CANB (harness CAN), GND, HOST1 (harness USB), HOST2 (harness USB), I2CB (harness I2C_BACKPLANE)

### Harnesses
I2C_BACKPLANE: SDA, SCL, ID-UP, RESET, ID-DN
USB: D_P, D_N
CAN: CAN_N, CAN_P

### Nets
GND: D107.2(GND) D108.2(GND) D109.2(GND) D110.2(GND) J100.5 J100.6 J100.7 J100.8 J101.3 J101.8 J102.7 J102.8 ; port GND
V_5P0: D107.5(VBUS) D108.5(VBUS) D109.5(VBUS) D110.5(VBUS) ; port 5V
V_ADJ1: J102.3 ; port ADJ1
V_ADJ2: J102.4 ; port ADJ2
CANA.CAN_N: J102.6 ; port CANA.CAN_N
CANA.CAN_P: J102.5 ; port CANA.CAN_P
CANB.CAN_N: J102.2 ; port CANB.CAN_N
CANB.CAN_P: J102.1 ; port CANB.CAN_P
I2C.ID-UP: D108.4(I/O2) ; port I2CB.ID-UP
I2C.RESET: D108.6(I/O1) ; port I2CB.RESET
I2C.SCL: D107.6(I/O1) ; port I2CB.SCL
I2C.SDA: D107.4(I/O2) ; port I2CB.SDA
US1.D_N: D110.6(I/O1) ; port HOST1.D_N
US1.D_P: D110.4(I/O2) ; port HOST1.D_P
US2.D_N: D109.6(I/O1) ; port HOST2.D_N
US2.D_P: D109.4(I/O2) ; port HOST2.D_P
US_HOST1_D_N: D110.1(I/O1) J101.5
US_HOST1_D_P: D110.3(I/O2) J101.4
US_HOST2_D_N: D109.1(I/O1) J101.2
US_HOST2_D_P: D109.3(I/O2) J101.1
US_ID: D108.3(I/O2) J101.6
US_RESET: D108.1(I/O1) J101.7
US_SCL: D107.1(I/O1) J101.10
US_SDA: D107.3(I/O2) J101.9
V_IN3_24P0: J100.1 J100.2 J100.3 J100.4 ; port 24V_IN

### Layout directives
differential pair; differential pair class DIFF_USB_EXT: US_HOST1_D_N, US_HOST1_D_P, US_HOST2_D_N, US_HOST2_D_P

### Notes on the sheet
- (near J100) Current Limit 4x2.5A
- PROJECT
- DESCRIPTION
- SIZE
- ENGINEER
- VARIANT
- A3
- TITLE
- MODIFIED
- RELEASE
- HIBER BV
  MOERMANSKKADE 600
  1013 BC, AMSTERDAM
  THE NETHERLANDS
- FILE NAME
- APPROVER
- SHEET
- APPROVED
- OF
- THIS DOCUMENT AND THE DATA DISCLOSED HEREIN OR HEREWITH IS THE PROPERTY OF HIBER INTERNATIONAL BV. IT CONTAINS CONFIDENTIAL AND PROPRIETARY INFORMATION THAT CANNOT BE REPRODUCED OR DIVULGED, IN WHOLE OR IN PART, WITHOUT WRITTEN AUTHORIZATION.

### Library data of the parts
D107-D110 = CMP-00780-2: as D111 on sheet H-00488 - Card Slot; Max Operating Temperature: 125°C; Lead Free: Lead Free; Contact Plating: Matte, Tin; Package Quantity: 1; Case/Package: SOT-666; Min Operating Temperature: -40°C; Length: 1.7mm; Breakdown Voltage: 6V; Packaging: Tape and Reel; REACH SVHC: No SVHC; Termination: SMD/SMT; Mount: Surface Mount; Power Line Protection: Yes; Radiation Hardening: No; RoHS: Yes; Leakage Current: 150nA; Polarity: Bidirectional, Unidirectional; Depth: 1.3mm; Number of Bidirectional Channels: 2; Number of Pins: 6; Height: 0.6mm; Reverse Standoff Voltage: 5V; Width: 1.3mm; Min Breakdown Voltage: 6V; Operating Supply Voltage: 5V; Max Breakdown Voltage: 6V
J100 J102 = CMP-01083-5: CONN SSL BRIDGE 8POS 2MM; RoHS: Yes; Mount: TH
J101 = CMP-01075-4: AVX INTERCONNECT - 009159010061916 - CARD EDGE CONN, DUAL SIDE, 10POS, SMD; RoHS: Yes; Mount: TH

## Sheet H-00488 - Connectors.SchDoc: Rear Side Connectors
size 403 x 281 mm; DocumentNumber: 10; SheetNumber: 10; SheetTotal: 12
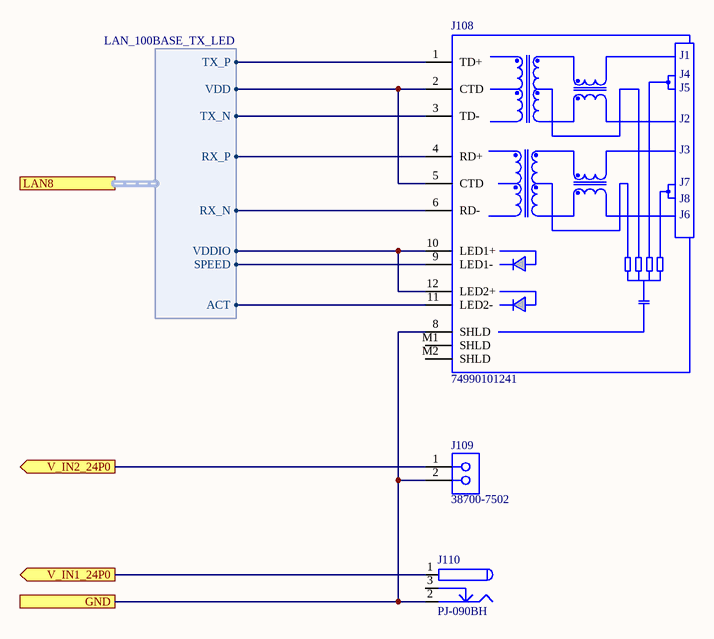
[diagram p3: H-00488 - Connectors.SchDoc]

### Parts
J108  74990101241  [WURTH_74990101241]
J109  38700-7502  [MOLEX_387007502]
J110  PJ-090BH  [CUI_PJ-090BH]

### Ports
GND, LAN8 (harness LAN_100BASE_TX_LED), V_IN1_24P0 (out), V_IN2_24P0 (out)

### Harnesses
LAN_100BASE_TX_LED: RX_N, RX_P, TX_P, TX_N, ACT, SPEED, VDDIO, VDD

### Nets
GND: J108.8(SHLD) J109.2 J110.2 ; port GND
LAN8.ACT: J108.11(LED2-) ; port LAN8.ACT
LAN8.RX_N: J108.6(RD-) ; port LAN8.RX_N
LAN8.RX_P: J108.4(RD+) ; port LAN8.RX_P
LAN8.SPEED: J108.9(LED1-) ; port LAN8.SPEED
LAN8.TX_N: J108.3(TD-) ; port LAN8.TX_N
LAN8.TX_P: J108.1(TD+) ; port LAN8.TX_P
LAN8.VDD: J108.2(CTD) J108.5(CTD) ; port LAN8.VDD
LAN8.VDDIO: J108.10(LED1+) J108.12(LED2+) ; port LAN8.VDDIO
V_IN1_24P0: J110.1 ; port V_IN1_24P0
V_IN2_24P0: J109.1 ; port V_IN2_24P0

Not connected (* = marked no-connect by the designer): J108 M1(SHLD) M2(SHLD); J110 3

### Notes on the sheet
- PROJECT
- DESCRIPTION
- SIZE
- ENGINEER
- VARIANT
- A3
- TITLE
- MODIFIED
- RELEASE
- HIBER BV
  MOERMANSKKADE 600
  1013 BC, AMSTERDAM
  THE NETHERLANDS
- FILE NAME
- APPROVER
- SHEET
- APPROVED
- OF
- THIS DOCUMENT AND THE DATA DISCLOSED HEREIN OR HEREWITH IS THE PROPERTY OF HIBER INTERNATIONAL BV. IT CONTAINS CONFIDENTIAL AND PROPRIETARY INFORMATION THAT CANNOT BE REPRODUCED OR DIVULGED, IN WHOLE OR IN PART, WITHOUT WRITTEN AUTHORIZATION.
- (in symbol CMP-01134-4) J1; J4; J5; J2; J3; J7; J8; J6

### Library data of the parts
J108 = CMP-01134-4: Datacom Transformer; Mount: TH; RoHS: Yes; Transformer Type: DATACOM TRANSFORMER; Terminal Finish: Tin; JESD-609 Code: e3
J109 = CMP-01125-1: Barrier Strip Terminal Block, 1 Row(s), 1 Deck(s); Number of Ways: 2; Number of Decks: 1; Safety Approval: UL,CSA; Fastening Method: SCREW; Terminal and Terminal Block Type: BARRIER STRIP TERMINAL BLOCK; Mount: Board; Number of Rows: 1; RoHS: Yes
J110 = CMP-01102-2: Circular DC Power Connector; Mount: TH; RoHS: Yes

## Sheet H-00488 - Release Checklist.SchDoc: Release Checklist
size 403 x 281 mm; DocumentNumber: 2; SheetNumber: 2; SheetTotal: 12
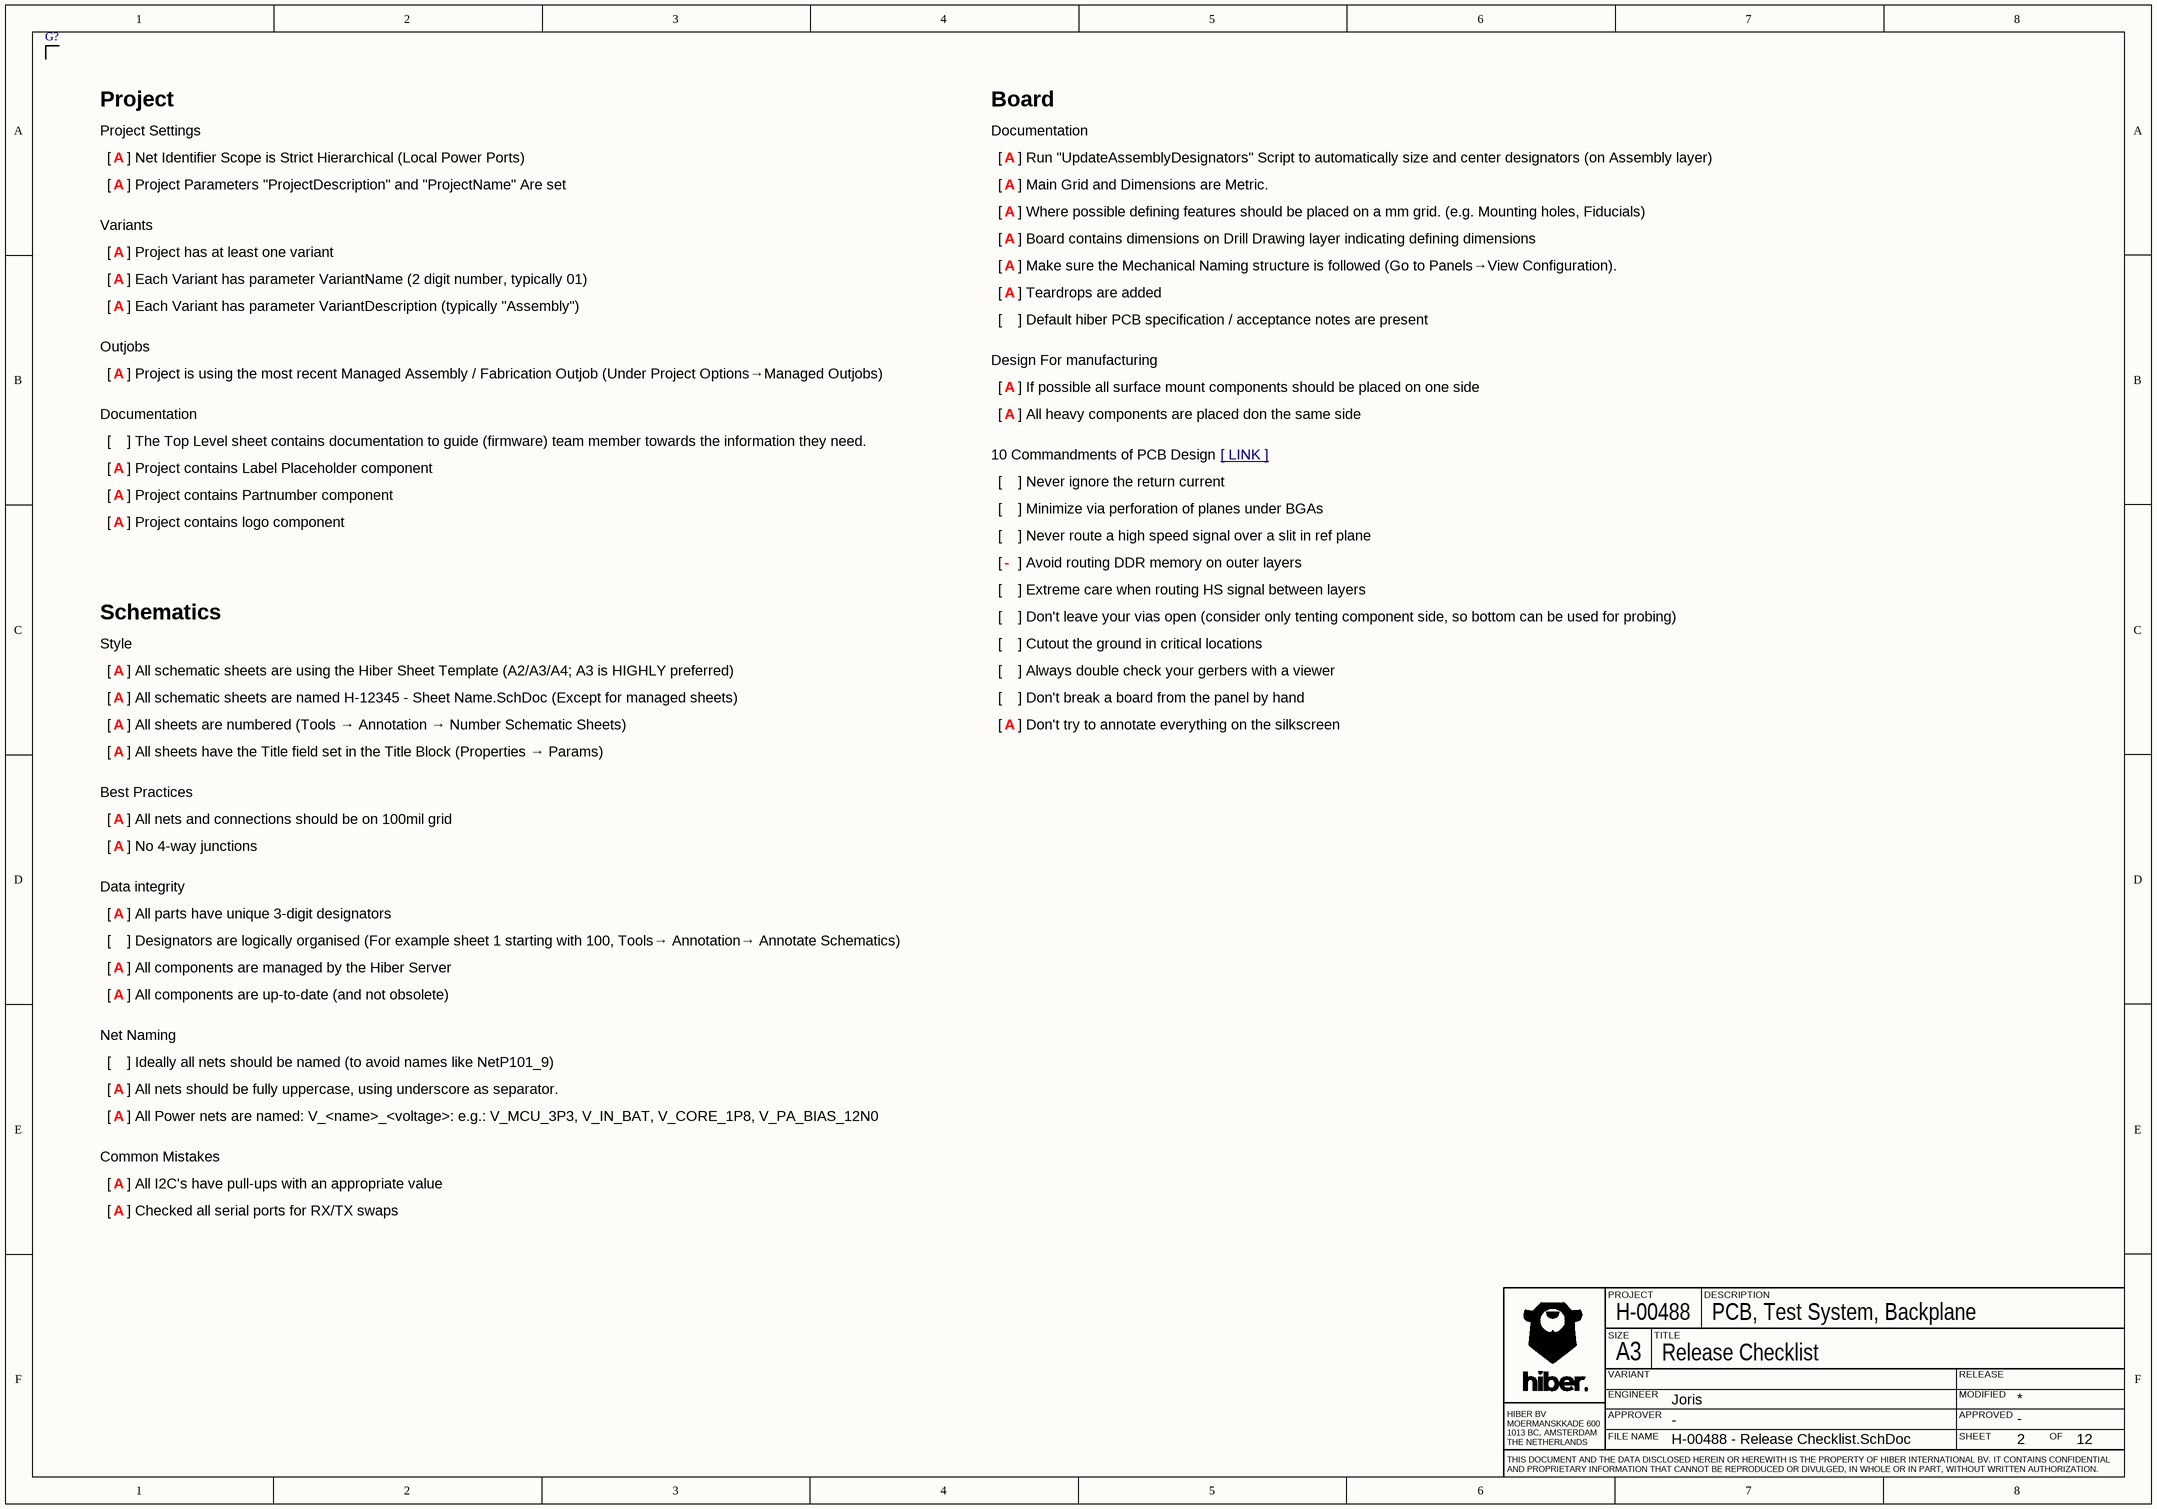
[diagram p4: H-00488 - Release Checklist.SchDoc]

### Parts
G?  CHECKLIST-COMMON  (value not drawn)  (graphical)

### Notes on the sheet
- A
- -
- PROJECT
- DESCRIPTION
- SIZE
- ENGINEER
- VARIANT
- A3
- TITLE
- MODIFIED
- RELEASE
- HIBER BV
  MOERMANSKKADE 600
  1013 BC, AMSTERDAM
  THE NETHERLANDS
- FILE NAME
- APPROVER
- SHEET
- APPROVED
- OF
- THIS DOCUMENT AND THE DATA DISCLOSED HEREIN OR HEREWITH IS THE PROPERTY OF HIBER INTERNATIONAL BV. IT CONTAINS CONFIDENTIAL AND PROPRIETARY INFORMATION THAT CANNOT BE REPRODUCED OR DIVULGED, IN WHOLE OR IN PART, WITHOUT WRITTEN AUTHORIZATION.
- (in symbol CMP-01142-2) Project; Board; Project Settings; Documentation; [    ] Net Identifier Scope is Strict Hierarchical (Local Power Ports); [    ] Run "UpdateAssemblyDesignators" Script to automatically size and center designators (on Assembly layer); [    ] Project Parameters "ProjectDescription" and "ProjectName" Are set; [    ] Main Grid and Dimensions are Metric.; [    ] Where possible defining features should be placed on a mm grid. (e.g. Mounting holes, Fiducials); Variants; [    ] Board contains dimensions on Drill Drawing layer indicating defining dimensions; [    ] Project has at least one variant; [    ] Make sure the Mechanical Naming structure is followed (Go to Panels→View Configuration).; [    ] Each Variant has parameter VariantName (2 digit number, typically 01); [    ] Teardrops are added; [    ] Each Variant has parameter VariantDescription (typically "Assembly"); [    ] Default hiber PCB specification / acceptance notes are present; Outjobs; Design For manufacturing; [    ] Project is using the most recent Managed Assembly / Fabrication Outjob (Under Project Options→Managed Outjobs); [    ] If possible all surface mount components should be placed on one side; [    ] All heavy components are placed don the same side; [    ] The Top Level sheet contains documentation to guide (firmware) team member towards the information they need.; 10 Commandments of PCB Design; [ LINK ]; [    ] Project contains Label Placeholder component; [    ] Never ignore the return current; [    ] Project contains Partnumber component; [    ] Minimize via perforation of planes under BGAs; [    ] Project contains logo component; [    ] Never route a high speed signal over a slit in ref plane; [    ] Avoid routing DDR memory on outer layers; [    ] Extreme care when routing HS signal between layers; Schematics; [    ] Don't leave your vias open (consider only tenting component side, so bottom can be used for probing); Style; [    ] Cutout the ground in critical locations; [    ] All schematic sheets are using the Hiber Sheet Template (A2/A3/A4; A3 is HIGHLY preferred); [    ] Always double check your gerbers with a viewer; [    ] All schematic sheets are named H-12345 - Sheet Name.SchDoc (Except for managed sheets); [    ] Don't break a board from the panel by hand; [    ] All sheets are numbered (Tools → Annotation → Number Schematic Sheets); [    ] Don't try to annotate everything on the silkscreen; [    ] All sheets have the Title field set in the Title Block (Properties → Params); Best Practices; [    ] All nets and connections should be on 100mil grid; [    ] No 4-way junctions; Data integrity; [    ] All parts have unique 3-digit designators; [    ] Designators are logically organised (For example sheet 1 starting with 100, Tools→ Annotation→ Annotate Schematics); [    ] All components are managed by the Hiber Server; [    ] All components are up-to-date (and not obsolete); Net Naming; [    ] Ideally all nets should be named (to avoid names like NetP101_9); [    ] All nets should be fully uppercase, using underscore as separator.; [    ] All Power nets are named: V_<name>_<voltage>: e.g.: V_MCU_3P3, V_IN_BAT, V_CORE_1P8, V_PA_BIAS_12N0; Common Mistakes; [    ] All I2C's have pull-ups with an appropriate value; [    ] Checked all serial ports for RX/TX swaps

### Library data of the parts
G? = CMP-01142-2

## Nets that join several sheets
GND: H-00488 - Top (C174.2 R201.2), SLOT1 (17 pins), SLOT2 (17 pins), SLOT3 (17 pins), SLOT4 (19 pins), SLOT5 (17 pins), SLOT6 (18 pins), SLOT7 (18 pins), H-00488 - Connectors Upstream (12 pins), H-00488 - Connectors (J108.8 J109.2 J110.2)
V_5P0: SLOT1 (6 pins), SLOT2 (6 pins), SLOT3 (6 pins), SLOT4 (6 pins), SLOT5 (6 pins), SLOT6 (6 pins), SLOT7 (6 pins), H-00488 - Connectors Upstream (D107.5 D108.5 D109.5 D110.5)
V_24P0: SLOT1 (R142_1.2 U102_1.11), SLOT2 (R142_2.2 U102_2.11), SLOT3 (R142_3.2 U102_3.11), SLOT4 (R142_4.2 U102_4.11), SLOT5 (R142_5.2 U102_5.11), SLOT6 (R142_6.2 U102_6.11), SLOT7 (R142_7.2 U102_7.11)
V_ADJ1: SLOT1 (J103_1.B10), SLOT2 (J103_2.B10), SLOT3 (J103_3.B10), SLOT4 (J103_4.B10), SLOT5 (J103_5.B10), SLOT6 (J103_6.B10), SLOT7 (J103_7.B10), H-00488 - Connectors Upstream (J102.3)
V_ADJ2: SLOT1 (J103_1.B9), SLOT2 (J103_2.B9), SLOT3 (J103_3.B9), SLOT4 (J103_4.B9), SLOT5 (J103_5.B9), SLOT6 (J103_6.B9), SLOT7 (J103_7.B9), H-00488 - Connectors Upstream (J102.4)
CANA.CAN_N: SLOT1 (J103_1.A7), SLOT2 (J103_2.A7), SLOT3 (J103_3.A7), SLOT4 (J103_4.A7), SLOT5 (J103_5.A7), SLOT6 (J103_6.A7), SLOT7 (J103_7.A7), H-00488 - Connectors Upstream (J102.6)
CANA.CAN_P: SLOT1 (J103_1.B7), SLOT2 (J103_2.B7), SLOT3 (J103_3.B7), SLOT4 (J103_4.B7), SLOT5 (J103_5.B7), SLOT6 (J103_6.B7), SLOT7 (J103_7.B7), H-00488 - Connectors Upstream (J102.5)
CANB.CAN_N: SLOT1 (J103_1.A8), SLOT2 (J103_2.A8), SLOT3 (J103_3.A8), SLOT4 (J103_4.A8), SLOT5 (J103_5.A8), SLOT6 (J103_6.A8), SLOT7 (J103_7.A8), H-00488 - Connectors Upstream (J102.2)
CANB.CAN_P: SLOT1 (J103_1.B8), SLOT2 (J103_2.B8), SLOT3 (J103_3.B8), SLOT4 (J103_4.B8), SLOT5 (J103_5.B8), SLOT6 (J103_6.B8), SLOT7 (J103_7.B8), H-00488 - Connectors Upstream (J102.1)
I2C0.A0: SLOT1 (U103_1.1), SLOT2 (U103_2.1), SLOT3 (U103_3.1), SLOT4 (U103_4.1), SLOT5 (U103_5.1), SLOT6 (U103_6.1), SLOT7 (U103_7.1)
I2C0.A1: SLOT1 (U103_1.2), SLOT2 (U103_2.2), SLOT3 (U103_3.2), SLOT4 (U103_4.2), SLOT5 (U103_5.2), SLOT6 (U103_6.2), SLOT7 (U103_7.2)
I2C0.SCL: SLOT1 (U102_1.20), SLOT2 (U102_2.20), SLOT3 (U102_3.20), SLOT4 (U102_4.20), SLOT5 (U102_5.20), SLOT6 (U102_6.20), SLOT7 (U102_7.20)
I2C0.SDA: SLOT1 (U102_1.19), SLOT2 (U102_2.19), SLOT3 (U102_3.19), SLOT4 (U102_4.19), SLOT5 (U102_5.19), SLOT6 (U102_6.19), SLOT7 (U102_7.19)

## Assembly variants
01: not fitted J100 J101 J102 J104 J105 J106 R103 R131 R132 R133 R151 R154 R162 R163 R164; alternate parts R8_1 -> CMP-00544-3